# EAGLE schematic twopropmixtiny (EAGLE 6.6.0)
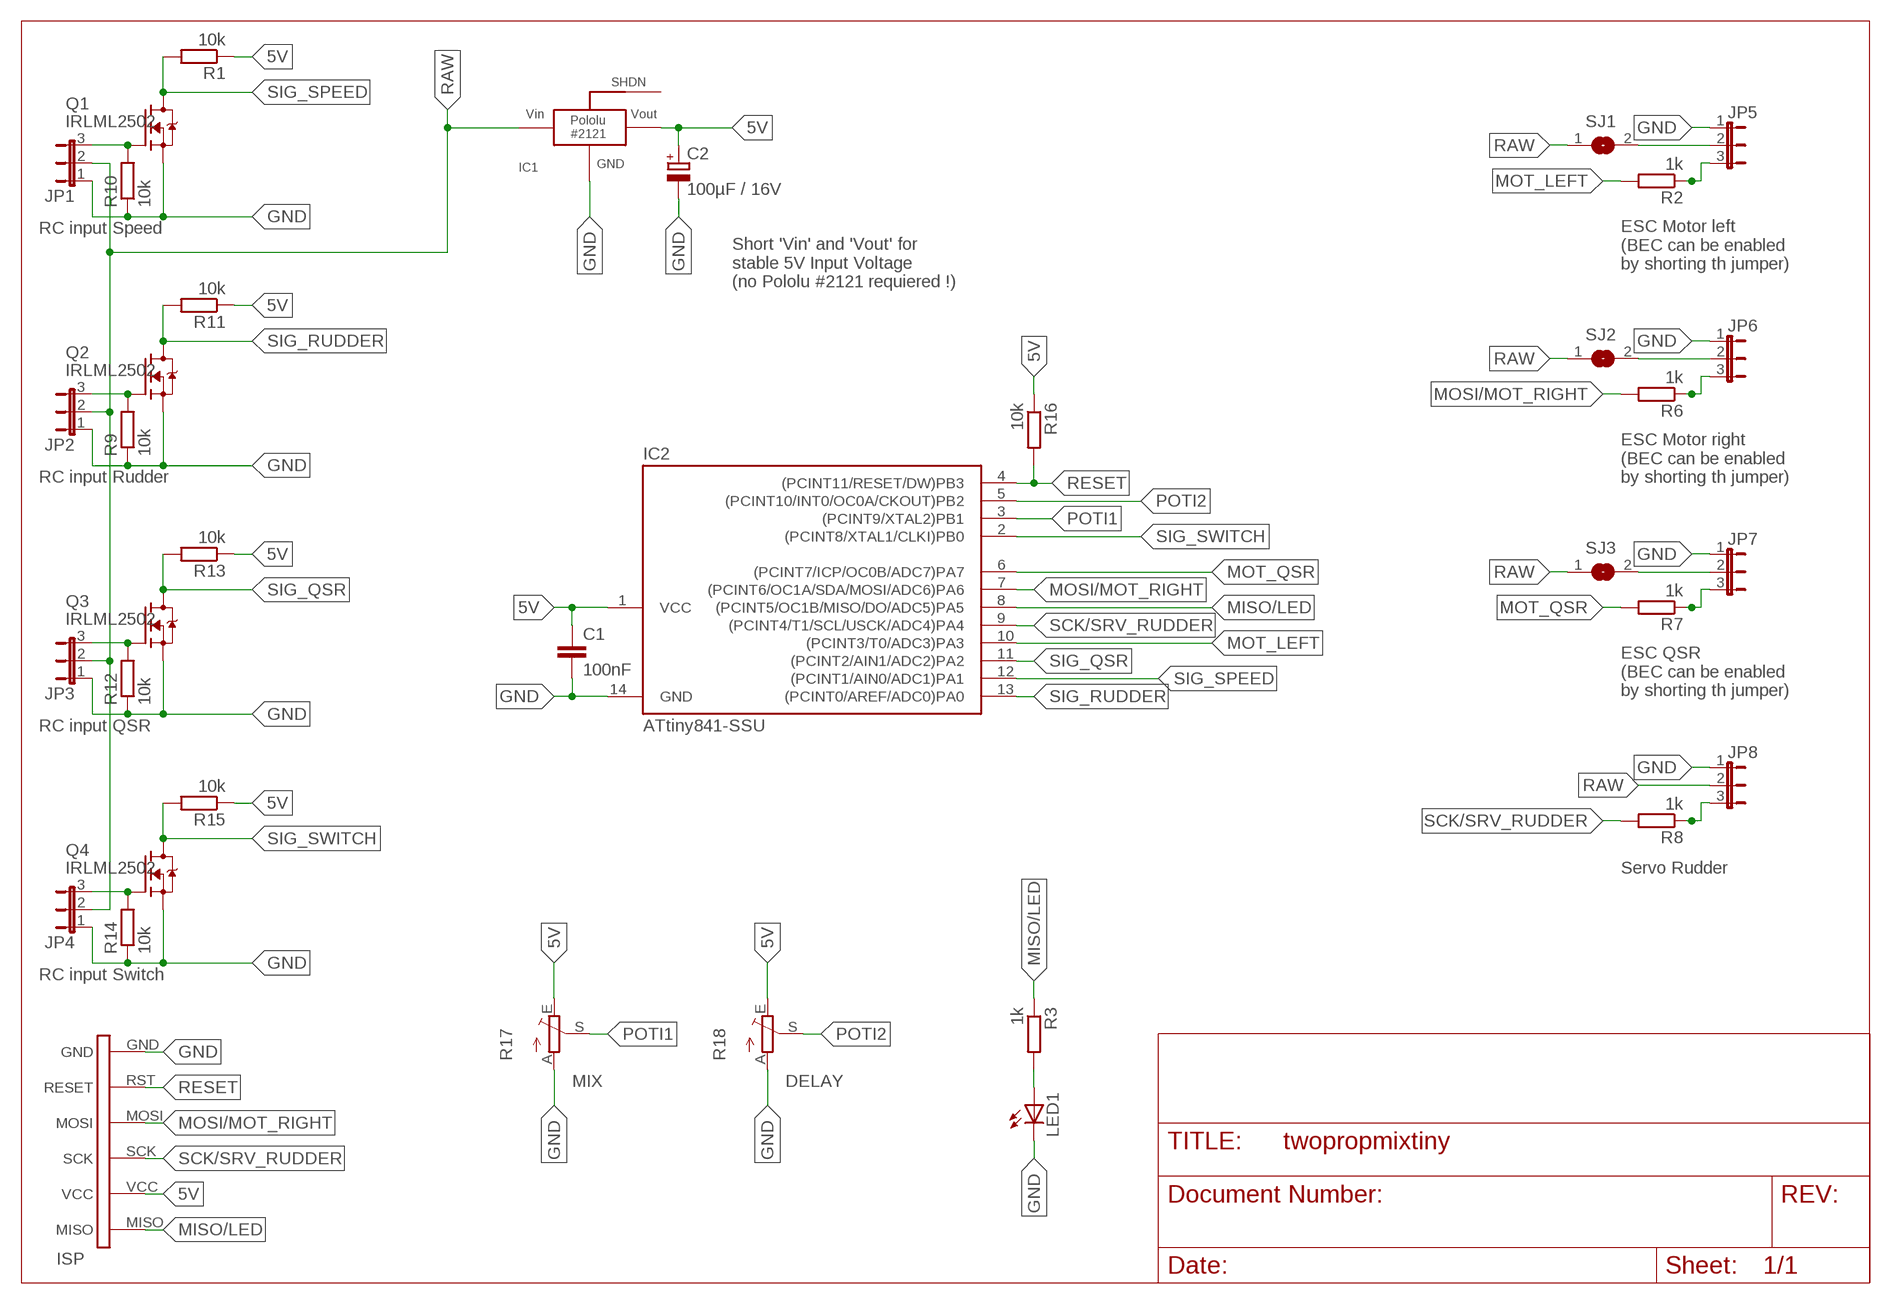
[diagram p0: schematic, sheet 1]

## Parts
C1  100nF  C-EUC0805  [C0805]
C2  100µF / 16V  CPOL-EUD  [PANASONIC_D]
IC1  POLOLU2121  [POLOLU2121]
IC2  ATtiny841-SSU  TINY24/44/84-SSU  [SOIC14]
JP1  JP2EJP2_OHNE_TEXT  [JP2]
JP2  JP2EJP2_OHNE_TEXT  [JP2]
JP3  JP2EJP2_OHNE_TEXT  [JP2]
JP4  JP2EJP2_OHNE_TEXT  [JP2]
JP5  JP2EJP2_OHNE_TEXT  [JP2]
JP6  JP2EJP2_OHNE_TEXT  [JP2]
JP7  JP2EJP2_OHNE_TEXT  [JP2]
JP8  JP2EJP2_OHNE_TEXT  [JP2]
LED1  LEDCHIPLED_0805  [CHIPLED_0805]
Q1  IRLML2502  [SOT23-3]
Q2  IRLML2502  [SOT23-3]
Q3  IRLML2502  [SOT23-3]
Q4  IRLML2502  [SOT23-3]
R1  10k  R-EU_R0805  [R0805]
R2  1k  R-EU_R0805  [R0805]
R3  1k  R-EU_R0805  [R0805]
R6  1k  R-EU_R0805  [R0805]
R7  1k  R-EU_R0805  [R0805]
R8  1k  R-EU_R0805  [R0805]
R9  10k  R-EU_R0805  [R0805]
R10  10k  R-EU_R0805  [R0805]
R11  10k  R-EU_R0805  [R0805]
R12  10k  R-EU_R0805  [R0805]
R13  10k  R-EU_R0805  [R0805]
R14  10k  R-EU_R0805  [R0805]
R15  10k  R-EU_R0805  [R0805]
R16  10k  R-EU_R0805  [R0805]
R17  TRIM_EU-PT10  [PT-10]
R18  TRIM_EU-PT10  [PT-10]
SJ1  SJ  [SJ]
SJ2  SJ  [SJ]
SJ3  SJ  [SJ]
U$1  ISP  [ISP]

## Nets
5V: C1.1 C2.+ IC1.VOUT IC2.1(VCC) R1.1 R11.1 R13.1 R15.1 R16.1 R17.E R18.E U$1.VCC
GND: C1.2 C2.- IC1.GND IC2.14(GND) JP1.1 JP2.1 JP3.1 JP4.1 JP5.1 JP6.1 JP7.1 JP8.1 LED1.C Q1.2(S) Q2.2(S) Q3.2(S) Q4.2(S) R9.1 R10.1 R12.1 R14.1 R17.A R18.A U$1.GND
MISO/LED: IC2.8((PCINT5/OC1B/MISO/DO/ADC5)PA5) R3.1 U$1.MISO
MOSI/MOT_RIGHT: IC2.7((PCINT6/OC1A/SDA/MOSI/ADC6)PA6) R6.2 U$1.MOSI
MOT_LEFT: IC2.10((PCINT3/T0/ADC3)PA3) R2.2
MOT_QSR: IC2.6((PCINT7/ICP/OC0B/ADC7)PA7) R7.2
N$1: JP1.3 Q1.1(G) R10.2
N$2: JP5.3 R2.1
N$3: JP2.3 Q2.1(G) R9.2
N$4: LED1.A R3.2
N$5: JP3.3 Q3.1(G) R12.2
N$6: JP6.3 R6.1
N$7: JP7.3 R7.1
N$8: JP8.3 R8.1
N$9: JP5.2 SJ1.2
N$10: JP6.2 SJ2.2
N$11: JP7.2 SJ3.2
N$19: JP4.3 Q4.1(G) R14.2
POTI1: IC2.3((PCINT9/XTAL2)PB1) R17.S
POTI2: IC2.5((PCINT10/INT0/OC0A/CKOUT)PB2) R18.S
RAW: IC1.VIN JP1.2 JP2.2 JP3.2 JP4.2 JP8.2 SJ1.1 SJ2.1 SJ3.1
RESET: IC2.4((PCINT11/RESET/DW)PB3) R16.2 U$1.RST(RESET)
SCK/SRV_RUDDER: IC2.9((PCINT4/T1/SCL/USCK/ADC4)PA4) R8.2 U$1.SCK
SIG_QSR: IC2.11((PCINT2/AIN1/ADC2)PA2) Q3.3(D) R13.2
SIG_RUDDER: IC2.13((PCINT0/AREF/ADC0)PA0) Q2.3(D) R11.2
SIG_SPEED: IC2.12((PCINT1/AIN0/ADC1)PA1) Q1.3(D) R1.2
SIG_SWITCH: IC2.2((PCINT8/XTAL1/CLKI)PB0) Q4.3(D) R15.2
Unconnected: IC1.SHDN

## Notes on the sheet
- RC input Speed
- ESC Motor left
  (BEC can be enabled
  by shorting th jumper)
- Short 'Vin' and 'Vout' for
  stable 5V Input Voltage
  (no Pololu #2121 requiered !)
- RC input Rudder
- ESC Motor right
  (BEC can be enabled
  by shorting th jumper)
- ESC QSR
  (BEC can be enabled
  by shorting th jumper)
- RC input QSR
- Servo Rudder
- RC input Switch
- MIX | DELAY
- ISP

## Library data of the parts
C1 = marco:C-EU: CAPACITOR, European symbol
C2 = rcl:CPOL-EU: POLARIZED CAPACITOR, European symbol
IC1 = marco:POLOLU2121
IC2 = avr-6:TINY24/44/84
JP1-JP8 = marco:JP2E: JUMPER
LED1 = marco:LED: LED OSRAM: - CHIPLED LG R971, LG N971, LY N971, LG Q971, LY Q971, LO R971, LY R971 LH N974, LH R974 LS Q976, LO Q976, LY Q976 LO Q996 - Hyper CHIPLED LW Q18S LB Q993, LB Q99A, LB R99A - SideLED LS A670, LO A670, LY A670, LG A670, LP A670 LB A673, LV A673, LT A673, LW A673 LH A674 LY A675 LS A676, LA A676, LO A676, LY A676, LW A676 LS A679, LY A679, LG A679 - Hyper Micro SIDELED® LS Y876, LA Y876, LO Y876, LY Y876 LT Y87S - SmartLED LW L88C, LW L88S LB L89C, LB L89S, LG L890 LS L89K, LO L89K, LY L89K LS L896, LA L896, LO L896, LY L896 - TOPLED LS T670, LO T670, LY T670, LG T670, LP T670 LSG T670, LSP T670, LSY T670, LOP T670, LYG T670 LG T671, LOG T671, LSG T671 LB T673, LV T673, LT T673, LW T673 LH T674 LS T676, LA T676, LO T676, LY T676, LB T676, LH T676, LSB T676, LW T676 LB T67C, LV T67C, LT T67C, LS T67K, LO T67K, LY T67K, LW E67C LS E67B, LA E67B, LO E67B, LY E67B, LB E67C, LV E67C, LT E67C LW T67C LS T679, LY T679, LG T679 LS T770, LO T770, LY T770, LG T770, LP T770 LB T773, LV T773, LT T773, LW T773 LH T774 LS E675, LA E675, LY E675, LS T675 LS T776, LA T776, LO T776, LY T776, LB T776 LHGB T686 LT T68C, LB T68C - Hyper Mini TOPLED® LB M676 - Mini TOPLED Santana® LG M470 LS M47K, LO M47K, LY M47K Source: http://www.osram.convergy.de LUXEON: - LUMILED® LXK2-PW12-R00, LXK2-PW12-S00, LXK2-PW14-U00, LXK2-PW14-V00 LXK2-PM12-R00, LXK2-PM12-S00, LXK2-PM14-U00 LXK2-PE12-Q00, LXK2-PE12-R00, LXK2-PE12-S00, LXK2-PE14-T00, LXK2-PE14-U00 LXK2-PB12-K00, LXK2-PB12-L00, LXK2-PB12-M00, LXK2-PB14-N00, LXK2-PB14-P00, LXK2-PB14-Q00 LXK2-PR12-L00, LXK2-PR12-M00, LXK2-PR14-Q00, LXK2-PR14-R00 LXK2-PD12-Q00, LXK2-PD12-R00, LXK2-PD12-S00 LXK2-PH12-R00, LXK2-PH12-S00 LXK2-PL12-P00, LXK2-PL12-Q00, LXK2-PL12-R00 Source: www.luxeon.com KINGBRIGHT: KA-3528ASYC Source: www.kingbright.com
Q1-Q4 = xmaker:IRLML2502: International Rectifier N-MOSFET.
R1-R3 R6-R16 = marco:R-EU_: RESISTOR, European symbol
R17 R18 = pot:TRIM_EU-: POTENTIOMETER
SJ1-SJ3 = jumper:SJ: SMD solder JUMPER
U$1 = marco:ISP